# Altium schematic sheet Safety Loops.SchDoc
size A4
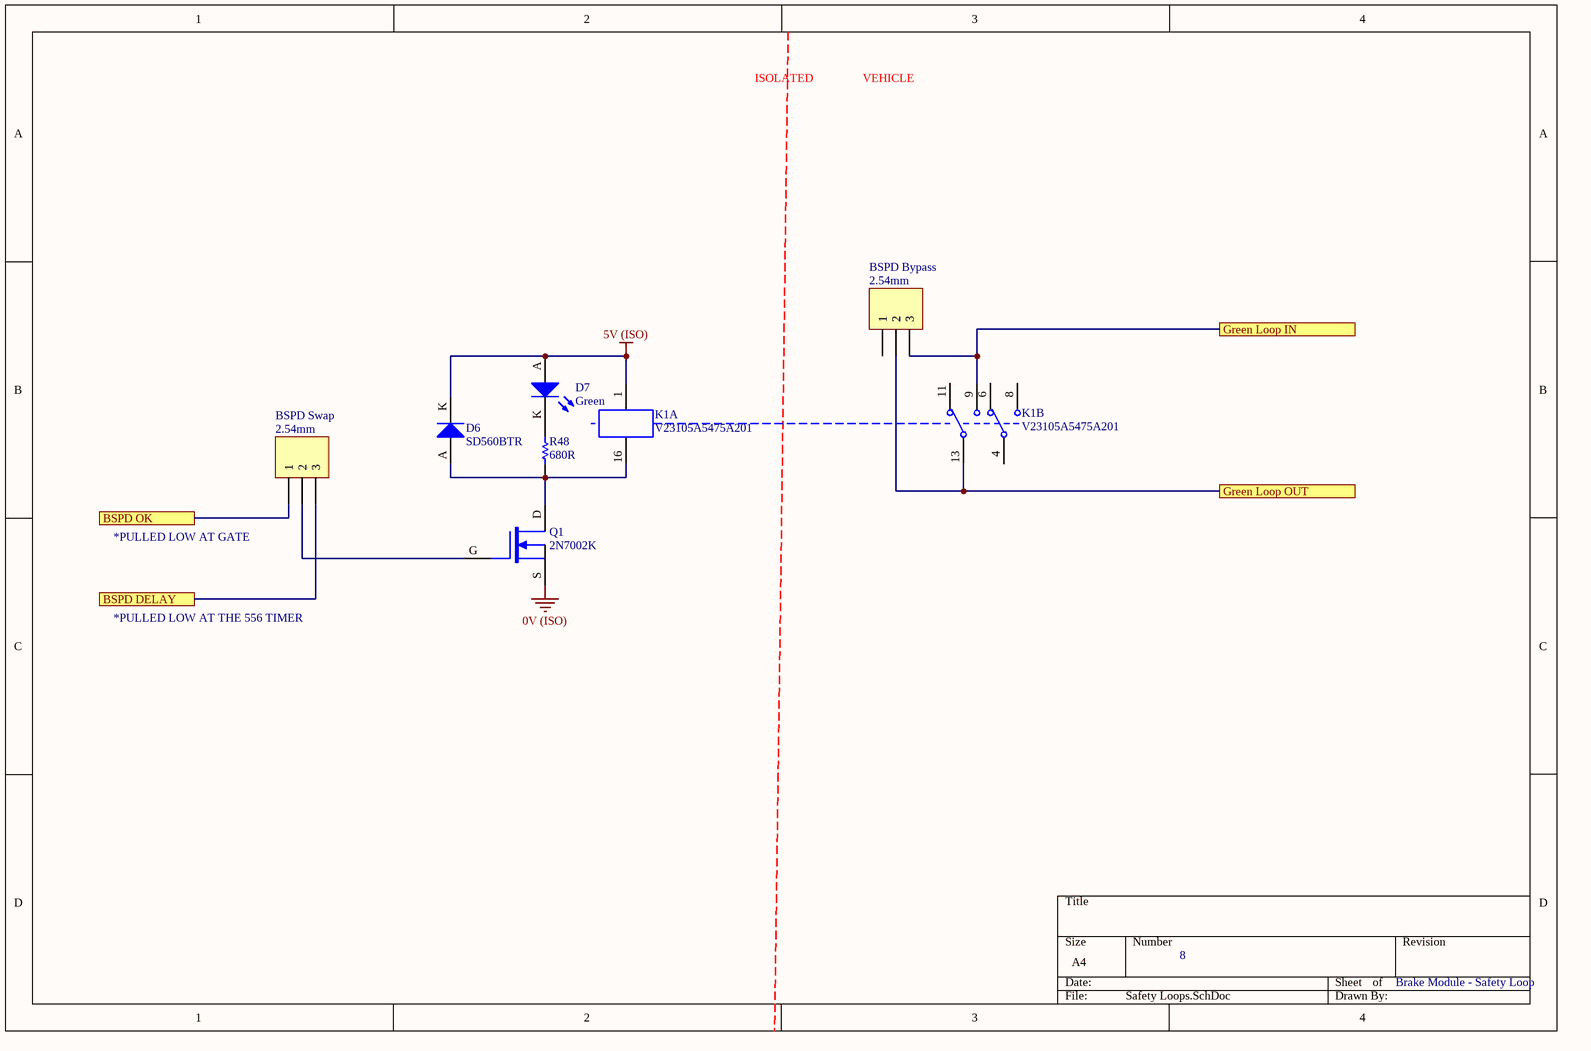
[diagram p0: Safety Loops.SchDoc]

## Parts
BSPD_Bypass  2.54mm  [TH 2.54mm Header 1x3]
BSPD_Swap  2.54mm  [TH 2.54mm Header 1x3]
D6  SD560BTR  [SMB Diode]
D7  Green  [0805 LED]
K1  V23105A5475A201  [TI 2-DIL]  (parts A,B of 2)
Q1  2N7002K  [ON SOT-23 MOSFET]
R48  680R  [0805]

## Ports
BSPD DELAY, BSPD OK, Green Loop IN, Green Loop OUT

## Nets
0V (ISO): Q1.S
5V (ISO): D6.K D7.A K1.1
BSPD DELAY: BSPD_Swap.3 ; port BSPD DELAY
BSPD OK: BSPD_Swap.1 ; port BSPD OK
Green Loop IN: BSPD_Bypass.3 K1.9 ; port Green Loop IN
Green Loop OUT: BSPD_Bypass.2 K1.13 ; port Green Loop OUT
NetBSPD_Swap_2: BSPD_Swap.2 Q1.G
NetD6_A: D6.A K1.16 Q1.D R48.1
NetD7_K: D7.K R48.2

Not connected (* = marked no-connect by the designer): BSPD_Bypass 1; K1 4 6 8 11

## Notes on the sheet
- ISOLATED
- VEHICLE
- *PULLED LOW AT GATE
- *PULLED LOW AT THE 556 TIMER
- 8
- Brake Module - Safety Loop

## Library data of the parts
BSPD_Bypass BSPD_Swap = TH 2.54mm Header 1x3: Positions: 3; Angle: 0; Flange: No; Contact: NA; Part Number: TH 2.54mm Header 1x3; Pitch: 2.54mm; Row Spacing: 2.54mm
D6 = SD560BTR: 1.2V_F 600V 5A SMB; Manufacturer: SMC Diode Solutions; Part Number: SD560BTR; Digikey Part Number: 1655-1530-2-ND; Digikey Link: https://www.digikey.com/product-detail/en/smc-diode-solutions/SD560BTR/1655-1530-2-ND/6022620
D7 = SML-210FTT86: Green LED Indication - Discrete 1.75V 0805 (2012 Metric); Manufacturer: ROHM Semiconductor; Part Number: SML-210FTT86; Colour: Green; Digikey Part Number: 511-1285-1-ND; Digikey Link: https://www.digikey.com/product-detail/en/rohm-semiconductor/SML-210FTT86/511-1285-1-ND/637098
K1 = V23105A5475A201: 5V DPDT Relay 3A 220VDC; Manufacturer: Axicom; Part Number: V23105A5475A201; Digikey Part Number: PB383-ND; Digikey Link: https://www.digikey.com/products/en?mpart=V23105A5001A201&v=41
Q1 = 2N7002K: 60V 380mA, NFET MOSTFET (Small Signal); Manufacturer: ON Semiconductor; Published: 24-Mar-1999; LatestRevisionDate: 29-May-2009; LatestRevisionNote: IPC-7351 Footprint Added.; PackageVersion: Sep-2000; PackageReference: SOT-343; Publisher: Altium Limited; PackageDescription: 4-Pin SOT-343 Package 1.3 mm Pitch, 2.1 mm Lead Span; Part Number: 2N7002K; Digikey Part Number: 2N7002KCT-ND; Digikey Link: https://www.digikey.com/product-detail/en/on-semiconductor/2N7002K/2N7002KCT-ND/2060375; Qty: 30
R48 = RC0805FR07680RL: Manufacturer: YAGEO; Tolerance: 0.01; Rated Voltage: 0.125W; Part Number: RC0805FR07680RL; Value: 680R; Material: FR-07; Digikey Part Number: 311-680CRCT-ND